# Altium project MB1605.PrjPcb (part 6 of 7)

## Sheet SDcard_eMMC.SchDoc: SDcard_eMMC
size A3; Date: Not used; ApprovedBy: Not used; CheckedBy: Not used; Author: Not used; CompanyName: STMicroelectronics; DrawnBy: Not used; Engineer: Not used; Organization: Not used; Address1: Not used; Address2: Not used; Address3: Not used; Address4: Not used; DocumentNumber: Not used; Revision: Not used; SheetNumber: 7; SheetTotal: 18; CurrentTime: Not used; CurrentDate: Not used; Time: Not used; DocumentFullPathAndName: Not used; DocumentName: Not used; ModifiedDate: Not used; ImagePath: Not used; ProjectName: Not used; Application_BuildNumber: Not used
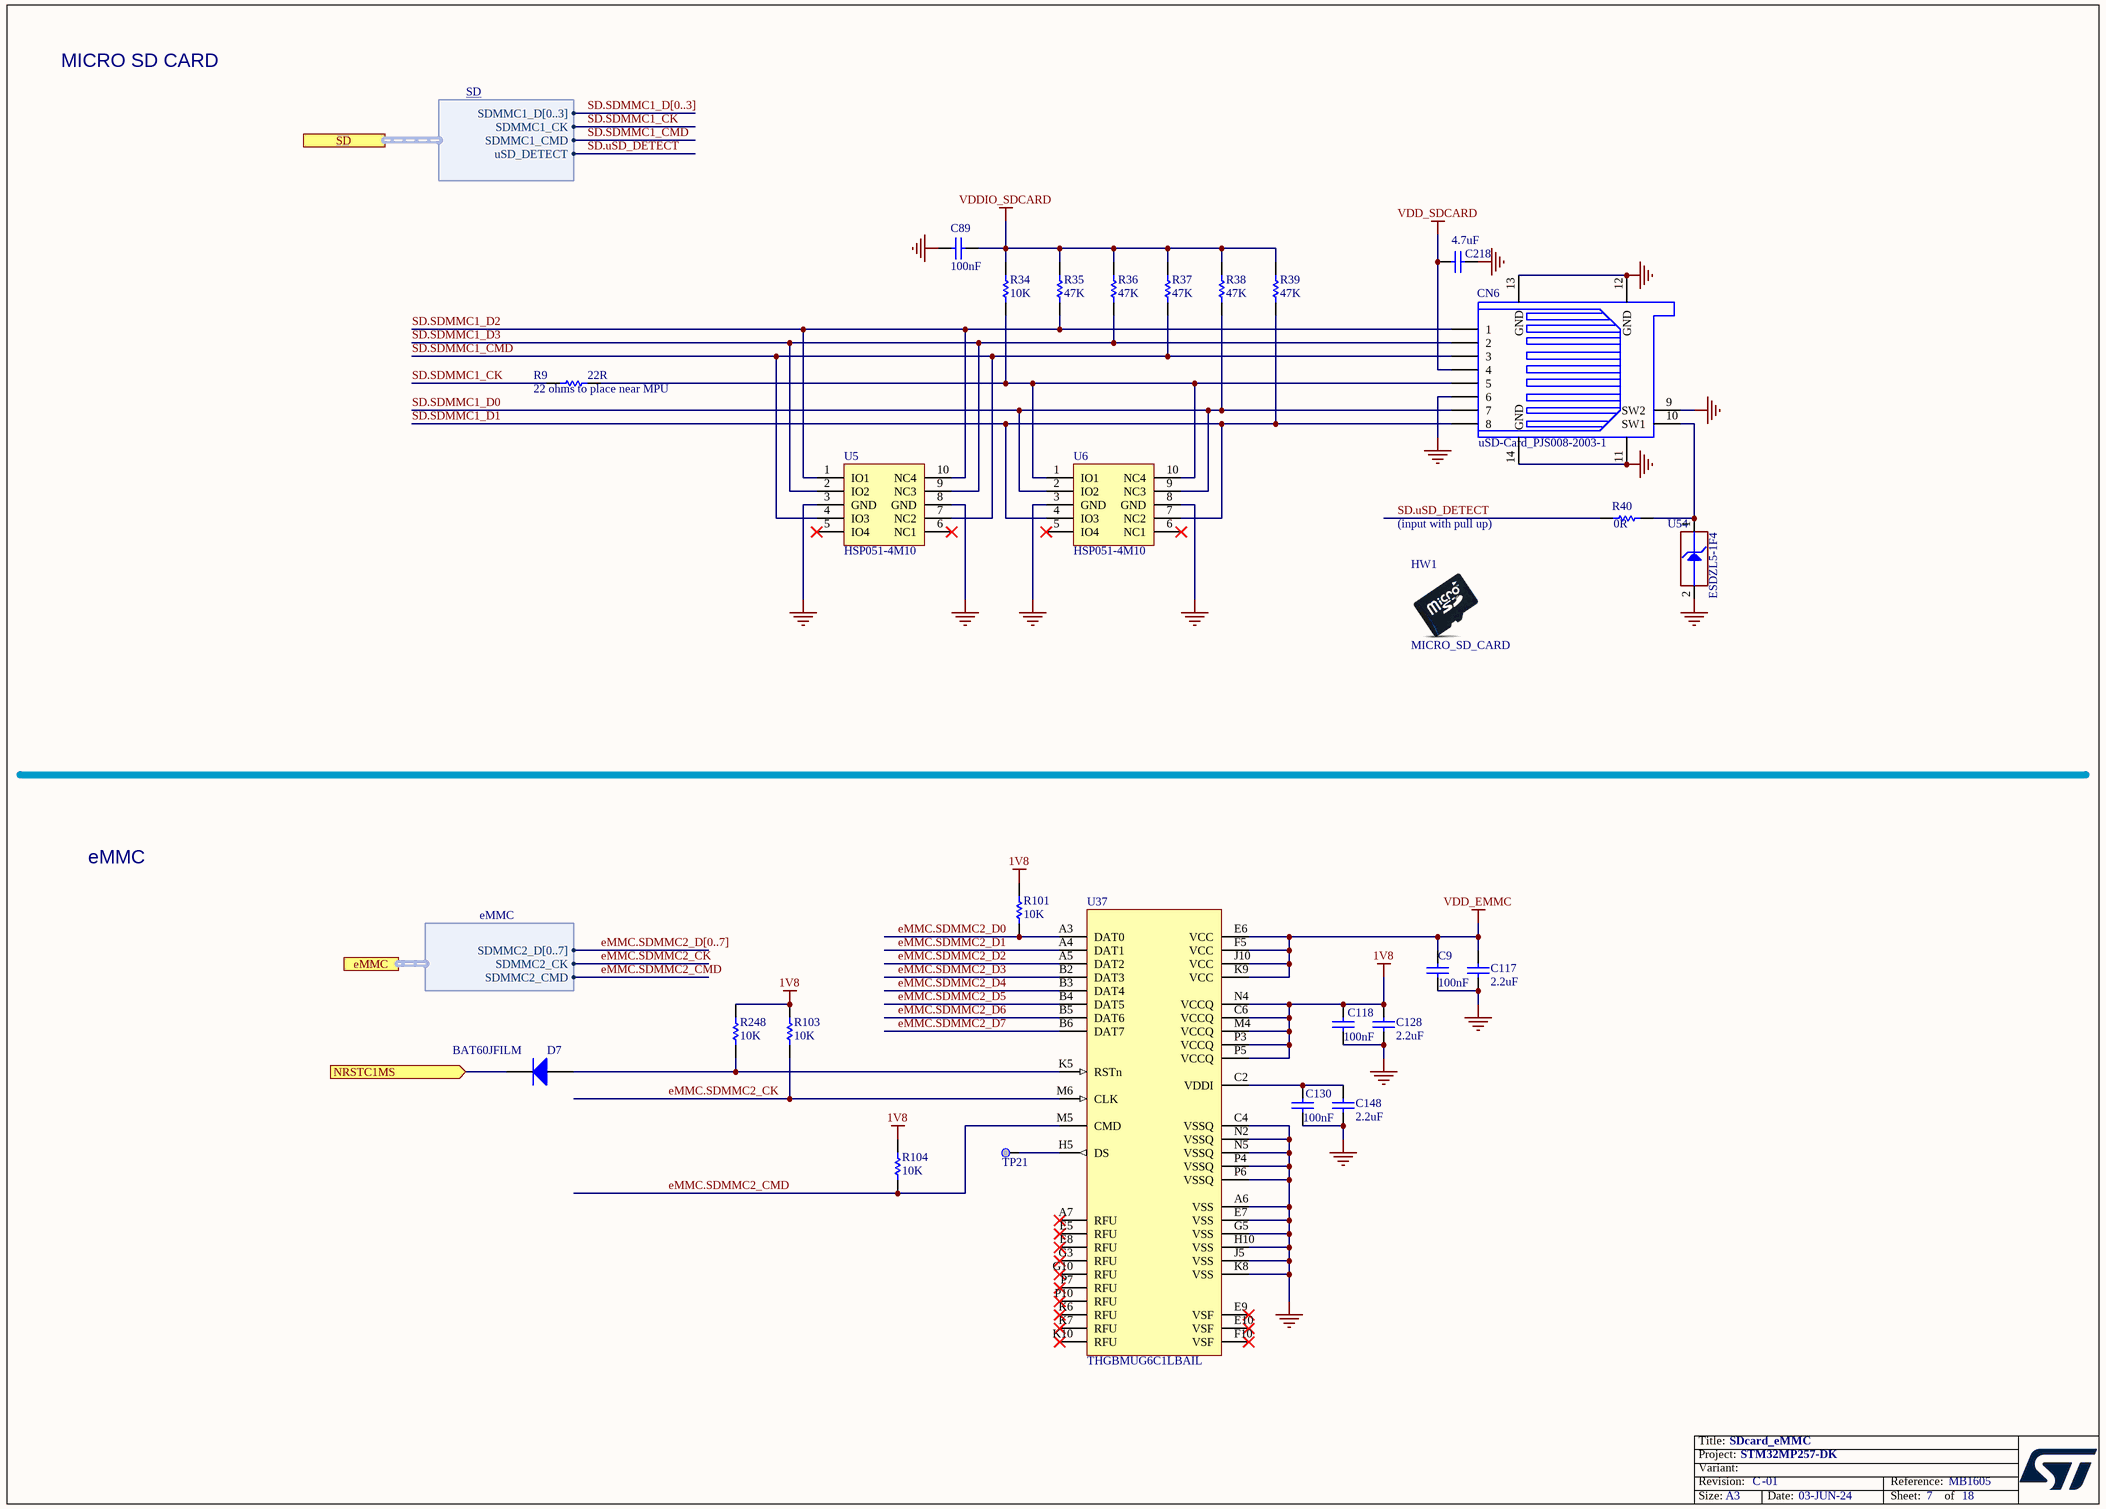
[diagram p15: SDcard_eMMC.SchDoc]

### Parts
C9  value 100nF  [C0402]  (hidden comment: Capacitor)
C89  value 100nF  [C0402]  (hidden comment: Capacitor)
C117  value 2.2uF  [C0402]  (hidden comment: Capacitor)
C118  value 100nF  [C0402]  (hidden comment: Capacitor)
C128  value 2.2uF  [C0402]  (hidden comment: Capacitor)
C130  value 100nF  [C0402]  (hidden comment: Capacitor)
C148  value 2.2uF  [C0402]  (hidden comment: Capacitor)
C218  value 4.7uF  [C0402]  (hidden comment: Capacitor)
CN6  value uSD-Card_PJS008-2003-1  [CON_MICROSD_YAMAICHI_PJS008-2003-1]  (hidden comment: microSD-PJS008-2003)
D7  BAT60JFILM  [DIO_SOD323]
HW1  Micro_SD_card  (mechanical)
R9  value 22R  [R0201_H0P23]  (hidden comment: Resistor)
R34  value 10K  [R0402]  (hidden comment: Resistor)
R35  value 47K  [R0402]  (hidden comment: Resistor)
R36  value 47K  [R0402]  (hidden comment: Resistor)
R37  value 47K  [R0402]  (hidden comment: Resistor)
R38  value 47K  [R0402]  (hidden comment: Resistor)
R39  value 47K  [R0402]  (hidden comment: Resistor)
R40  value 0R  [R0402]  (hidden comment: Resistor)
R101  value 10K  [R0402]  (hidden comment: Resistor)
R103  value 10K  [R0402]  (hidden comment: Resistor)
R104  value 10K  [R0402]  (hidden comment: Resistor)
R248  value 10K  [R0402]  (hidden comment: Resistor)
TP21  Test Point  [TP_SMD_1MM]  (value not drawn)  (no BOM)
U5  HSP051-4M10  [ESD_UQFN-10L_2P5X1_P050]
U6  HSP051-4M10  [ESD_UQFN-10L_2P5X1_P050]
U37  value THGBMUG6C1LBAIL  [ICC_WFBGA153_13X11P5_P050]  (hidden comment: eMMC_THGBMUG6C1LBAIL)
U54  value ESDZL5-1F4  [ESD_ST0201]  (hidden comment: ESD-TRANSIL)

### Ports
eMMC (harness eMMC), NRSTC1MS (in), SD (harness SD)

### Harnesses
SD: SDMMC1_D[0..3], SDMMC1_CK, SDMMC1_CMD, uSD_DETECT
eMMC: SDMMC2_CK, SDMMC2_CMD, SDMMC2_D[0..7]

### Nets
1V8: C118.2 C128.2 R101.2 R103.2 R104.2 R248.2 U37.C6(VCCQ) U37.M4(VCCQ) U37.N4(VCCQ) U37.P3(VCCQ) U37.P5(VCCQ)
GND: C9.1 C89.1 C117.1 C118.1 C128.1 C130.1 C148.1 C218.1 CN6.6 CN6.9(SW2) CN6.11(GND) CN6.12(GND) CN6.13(GND) CN6.14(GND) U5.3(GND) U5.8(GND) U6.3(GND) U6.8(GND) U37.A6(VSS) U37.C4(VSSQ) U37.E7(VSS) U37.G5(VSS) U37.H10(VSS) U37.J5(VSS) U37.K8(VSS) U37.N2(VSSQ) U37.N5(VSSQ) U37.P4(VSSQ) U37.P6(VSSQ) U54.2(GND)
VDD_EMMC: C9.2 C117.2 U37.E6(VCC) U37.F5(VCC) U37.J10(VCC) U37.K9(VCC)
VDD_SDCARD: C218.2 CN6.4
VDDIO_SDCARD: C89.2 R34.2 R35.2 R36.2 R37.2 R38.2 R39.2
eMMC.SDMMC2_CK: R103.1 U37.M6(CLK) ; port eMMC.SDMMC2_CK
eMMC.SDMMC2_CMD: R104.1 U37.M5(CMD) ; port eMMC.SDMMC2_CMD
eMMC.SDMMC2_D0: R101.1 U37.A3(DAT0)
eMMC.SDMMC2_D1: U37.A4(DAT1)
eMMC.SDMMC2_D2: U37.A5(DAT2)
eMMC.SDMMC2_D3: U37.B2(DAT3)
eMMC.SDMMC2_D4: U37.B3(DAT4)
eMMC.SDMMC2_D5: U37.B4(DAT5)
eMMC.SDMMC2_D6: U37.B5(DAT6)
eMMC.SDMMC2_D7: U37.B6(DAT7)
NRSTC1MS: D7.2(K) ; port NRSTC1MS
SD.SDMMC1_CK: R9.1 ; port SD.SDMMC1_CK
SD.SDMMC1_CMD: CN6.3 R37.1 U5.4(IO3) U5.7(NC2) ; port SD.SDMMC1_CMD
SD.SDMMC1_D0: CN6.7 R38.1 U6.2(IO2) U6.9(NC3)
SD.SDMMC1_D1: CN6.8 R39.1 U6.4(IO3) U6.7(NC2)
SD.SDMMC1_D2: CN6.1 R35.1 U5.1(IO1) U5.10(NC4)
SD.SDMMC1_D3: CN6.2 R36.1 U5.2(IO2) U5.9(NC3)
SD.uSD_DETECT: R40.1 ; port SD.uSD_DETECT
NetC130_2: C130.2 C148.2 U37.C2(VDDI)
NetCN6_5: CN6.5 R9.2 R34.1 U6.1(IO1) U6.10(NC4)
NetCN6_10: CN6.10(SW1) R40.2 U54.1(IO1)
NetD7_1: D7.1(A) R248.1 U37.K5(RSTn)
NetTP21_1: TP21.1 U37.H5(DS)

Not connected (* = marked no-connect by the designer): U5 5(IO4)* 6(NC1)*; U6 5(IO4)* 6(NC1)*; U37 A7(RFU)* E5(RFU)* E8(RFU)* E9(VSF)* E10(VSF)* F10(VSF)* G3(RFU)* G10(RFU)* K6(RFU)* K7(RFU)* K10(RFU)* P7(RFU)* P10(RFU)*

### Buses and harness runs
bus eMMC.SDMMC2_D[0..7]
bus SD.SDMMC1_D[0..3]

### Notes on the sheet
- MICRO SD CARD
- (near R9) 22 ohms to place near MPU
- (near HW1) (input with pull up)
- eMMC
- Title:
- Project:
- Size:
- Revision:
- Variant:
- A3
- -
- Date:
- Reference:
- Sheet:
- of

### Library data of the parts
C9 C89 C118 C130 = MCD-00006: Capacitor, MLCC, 100nF, 16V, X7R, +/-10%, 0402, T=0.5mm; Part_Preference: Recommended; Manufacturer: YAGEO; Manufacturer_Part_Number: CC0402KRX7R7BB104; Alternate_Manufacturer: MURATA; Alternate_Manufacturer_Part_Number: GCM155R71C104KA55D; Partial_Alternate_Internal_Part_Number: MCD-03299; Order_Code_RS: 616-9701; Component_Country_Of_Origin: China; Alternate_EMS: M; ID: 2474; ShowFields: YES; Internal_Part_Number: MCD-00006; Status: Released; Part_Type: Capacitor; Package: 0402; ComponentLink1Description: Datasheet; ComponentLink1URL: http://tunmcdsvn.tun.st.com/Component_Documentation_Library/Trunk/Capacitor/YAGEO_X7R_Series; Order_Code_Digikey: 311-1338-1-ND; Order_Code_Farnell: 9402047
C117 C128 C148 = MCD-02606: Capacitor, MLCC, 2.2uF, 6.3V, X5R, +/-10%, 0402, T=0.5mm; Part_Preference: Recommended; Manufacturer: YAGEO; Manufacturer_Part_Number: CC0402KRX5R5BB225; Order_Code_RS: 1992205; ShowFields: YES; ID: 4712; Component_Country_Of_Origin: China°; Internal_Part_Number: MCD-02606; Status: Checked; Part_Type: Capacitor; Package: 0402; ComponentLink1URL: http://tunmcdsvn.tun.st.com/Component_Documentation_Library/Trunk/Capacitor/YAGEO_X5R_Series; Order_Code_Digikey: 311-1682-2-ND; Order_Code_Farnell: 3366429
C218 = MCD-01356: Capacitor, MLCC, 4.7uF, 6V3, X5R, 20%, 0402, T=0,5mm; Manufacturer_Part_Number: GRM155R60J475ME47; Manufacturer: MURATA; Alternate_Manufacturer_Part_Number: GRM155R60J475ME87; Part_Preference: Recommended; Provided_By: SUBCO; ECCN_EU: NEC; ECCN_US: EAR99; Order_Code_RS: 814-5230; Component_Country_Of_Origin: Japan; ID: 3456; ShowFields: YES; Internal_Part_Number: MCD-01356; Status: Released; Part_Type: Capacitor; Package: 0402; ComponentLink1Description: Datasheet; ComponentLink1URL: http://tunmcdsvn.tun.st.com/Component_Documentation_Library/Trunk/Capacitor/MURATA_GRM_Series; Alternate_Manufacturer: MURATA; Order_Code_Digikey: 490-5915-1-ND; Order_Code_Farnell: 2666407
CN6 = MCD-00023: MicroSD Card Conn, Reversed-Type, Mnt Push-Push, Positionning holes; Manufacturer_Part_Number: PJS008-2003-1; Manufacturer: YAMAICHI; Part_Type: Connector; Part_Preference: Recommended; Provided_By: SUBCO; Component_Country_Of_Origin: Unknown; ID: 2492; ShowFields: YES; Internal_Part_Number: MCD-00023; ComponentLink1Description: Datasheet; ECCN_US: n/a; ECCN_EU: n/a; Status: Released; ComponentLink1URL: http://tunmcdsvn.tun.st.com/Component_Documentation_Library/Trunk/Connector/YAMAICHI_PJS_Series/; Alternate_Manufacturer: N/A; Alternate_Manufacturer_Part_Number: N/A; Order_Code_Digikey: N/A; Order_Code_Farnell: N/A; Order_Code_RS: N/A
D7 = MCD-00034: BMS_Part_Number: 9151097; Part_Type: Diode; Part_Preference: Recommended; Manufacturer: STMICROELECTRONICS; Manufacturer_HQ_COO: EU; Component_Country_Of_Origin: China; ShowFields: YES; ID: 2483; Internal_Part_Number: MCD-00034; Value: BAT60JFILM; Status: Released; Manufacturer_Part_Number: BAT60JFILM; ComponentLink1URL: http://tunmcdsvn.tun.st.com/Component_Datasheet_Library/Trunk/Diodes/STM_Diode_BAT60JFILM-SOD323
HW1 = MCD-03307: MICRO_SD_CARD, SANDISK, 16GB, Class10, 3V; Part_Type: Mechanical; Part_Preference: Recommended; Manufacturer_Part_Number: SDSDQAD-016G; Order_Code_RS: 220-8618; Component_Country_Of_Origin: China°; ShowFields: YES; ID: 5423; Internal_Part_Number: MCD-03307; Value: MICRO_SD_CARD; Status: Released; Manufacturer: SANDISK; Package: N/A; ComponentLink1URL: http://tunmcdsvn.tun.st.com/Component_Documentation_Library/Trunk/Mechanical/SANDISK_SDSDQAD-016G; Order_Code_Digikey: N/A; Order_Code_Farnell: N/A
R9 = MCD-02978: Resistor, 22R, 0201, +/-1%, 1/20W; Manufacturer_Part_Number: RC0201FR-0722RL; Manufacturer: YAGEO; Part_Preference: Recommended; Order_Code_RS: 198-7593; ID: 5094; ShowFields: YES; Component_Country_Of_Origin: China; Internal_Part_Number: MCD-02978; Status: Checked; Part_Type: Resistor; ComponentLink1URL: http://tunmcdsvn.tun.st.com/Component_Documentation_Library/Trunk/Resistor/YAGEO_RC_L_Series; Package: 0201; Order_Code_Digikey: YAG2518TR-ND; Order_Code_Farnell: 2693564
R34 R101 R103 R104 R248 = MCD-00053: Resistor,10K,0402,1%,1/16W; Manufacturer_Part_Number: RC0402FR-0710KL; Manufacturer: YAGEO; BMS_Part_Number: 9131590; Part_Preference: Recommended; ECCN_US: EAR99; ECCN_EU: NEC; Provided_By: SUBCO; Component_Country_Of_Origin: China; ID: 2539; ShowFields: YES; Internal_Part_Number: MCD-00053; ComponentLink1Description: Datasheet; Status: Released; Part_Type: Resistor; ComponentLink1URL: http://tunmcdsvn.tun.st.com/Component_Documentation_Library/Trunk/Resistor/YAGEO_RC_L_Series; Package: 0402; Order_Code_Digikey: 311-10.0KLRCT-ND; Order_Code_Farnell: 9239359; Order_Code_RS: N/A
  R34: Alternate_Manufacturer: N/A; Alternate_Manufacturer_Part_Number: N/A
R35-R39 = MCD-00063: Resistor,47K,0402,1%,1/16W; Manufacturer_Part_Number: RC0402FR-0747KL; Manufacturer: YAGEO; Part_Preference: Recommended; ECCN_US: EAR99; ECCN_EU: NEC; Provided_By: SUBCO; Component_Country_Of_Origin: China; ID: 2528; ShowFields: YES; Internal_Part_Number: MCD-00063; ComponentLink1Description: Datasheet; Status: Released; Part_Type: Resistor; ComponentLink1URL: http://tunmcdsvn.tun.st.com/Component_Documentation_Library/Trunk/Resistor/YAGEO_RC_L_Series; Package: 0402; Alternate_Manufacturer: N/A; Alternate_Manufacturer_Part_Number: N/A; Order_Code_Digikey: 311-47.0KLRCT-ND; Order_Code_Farnell: 9239430; Order_Code_RS: N/A
R40 = MCD-00052: Resistor,0R,0402,5%,1/16W; Manufacturer_Part_Number: RC0402JR-070RL; Manufacturer: YAGEO; Part_Preference: Recommended; ECCN_US: EAR99; ECCN_EU: NEC; Provided_By: SUBCO; Order_Code_RS: 618-5804; Component_Country_Of_Origin: China; ID: 2540; ShowFields: YES; Internal_Part_Number: MCD-00052; ComponentLink1Description: Datasheet; Status: Released; Part_Type: Resistor; ComponentLink1URL: http://tunmcdsvn.tun.st.com/Component_Documentation_Library/Trunk/Resistor/YAGEO_RC_L_Series; Package: 0402; Alternate_Manufacturer: N/A; Alternate_Manufacturer_Part_Number: N/A; Order_Code_Digikey: 311-0.0JRCT-ND; Order_Code_Farnell: 9232516RL
TP21 = MCD-00074: Test Point 1mm; Part_Type: Misc; Part_Preference: Recommended; ID: 2518; ShowFields: YES; Internal_Part_Number: MCD-00074; Status: Released; Manufacturer_Part_Number: n/a; Manufacturer: n/a; ComponentLink1Description: Datasheet; ComponentLink1URL: http://na; ECCN_US: n/a; ECCN_EU: n/a; Provided_By: n/a; Order_Code_Digikey: N/A; Order_Code_Farnell: N/A; Order_Code_RS: N/A
U5 U6 = MCD-00667: 4-line ESD protection for high speed lines; Part_Type: Diode; Manufacturer: STMICROELECTRONICS; BMS_Part_Number: 9179041; Manufacturer_HQ_COO: EU; Part_Preference: Recommended; ECCN_US: EAR99; ECCN_EU: NEC; Provided_By: SUBCO with ST control; Component_Country_Of_Origin: Philippines; ID: 3081; ShowFields: YES; Internal_Part_Number: MCD-00667; Value: HSP051-4M10; Status: Released; Manufacturer_Part_Number: HSP051-4M10; Package: uQFN-10L; ComponentLink1Description: Datasheet; ComponentLink1URL: http://tunmcdsvn.tun.st.com/Component_Documentation_Library/Trunk/Diode/STMICROELECTRONICS_HSP051-4M10; Order_Code_Digikey: N/A; Order_Code_Farnell: N/A; Order_Code_RS: N/A
U37 = MCD-04155: Memory, eMMC, 3V3, 8Gbit, 52MHz , V5.1; Part_Type: IC; Part_Preference: Recommended; Manufacturer: KIOXIA; ShowFields: YES; ID: 6271; ComponentLink1URL: http://tunmcdsvn.tun.st.com/Component_Documentation_Library/Trunk/IC/KIOXIA_THGBMUG6C1LBAIL; Internal_Part_Number: MCD-04155; Status: New; Manufacturer_Part_Number: THGBMUG6C1LBAIL; Package: WFBGA153; Order_Code_Digikey: 1853-THGBMUG6C1LBAIL-ND; Order_Code_Farnell: N/A; Order_Code_RS: N/A
U54 = MCD-03501: ESD protection , 0201; Part_Type: IC; Part_Preference: Recommended; Manufacturer: STMICROELECTRONICS; ShowFields: YES; ID: 5617; Order_Code_RS: 163-7318; Internal_Part_Number: MCD-03501; Status: New; Manufacturer_Part_Number: ESDZL5-1F4; ComponentLink1URL: http://tunmcdsvn.tun.st.com/Component_Documentation_Library/Trunk/IC/STMICROELECTRONICS_ESDZL5-1F4; Order_Code_Digikey: 497-17544-2-ND; Order_Code_Farnell: ESDZL5-1F4; Package: 0201; Full_Alternate_Internal_Part_Number: N/A

## Sheet ETHERNET.SchDoc: ETHERNET
size A3; Date: Not used; ApprovedBy: Not used; CheckedBy: Not used; Author: Not used; CompanyName: STMicroelectronics; DrawnBy: Not used; Engineer: Not used; Organization: Not used; Address1: Not used; Address2: Not used; Address3: Not used; Address4: Not used; DocumentNumber: Not used; Revision: Not used; SheetNumber: 8; SheetTotal: 18; CurrentTime: Not used; CurrentDate: Not used; Time: Not used; DocumentFullPathAndName: Not used; DocumentName: Not used; ModifiedDate: Not used; ImagePath: Not used; ProjectName: Not used; Application_BuildNumber: Not used
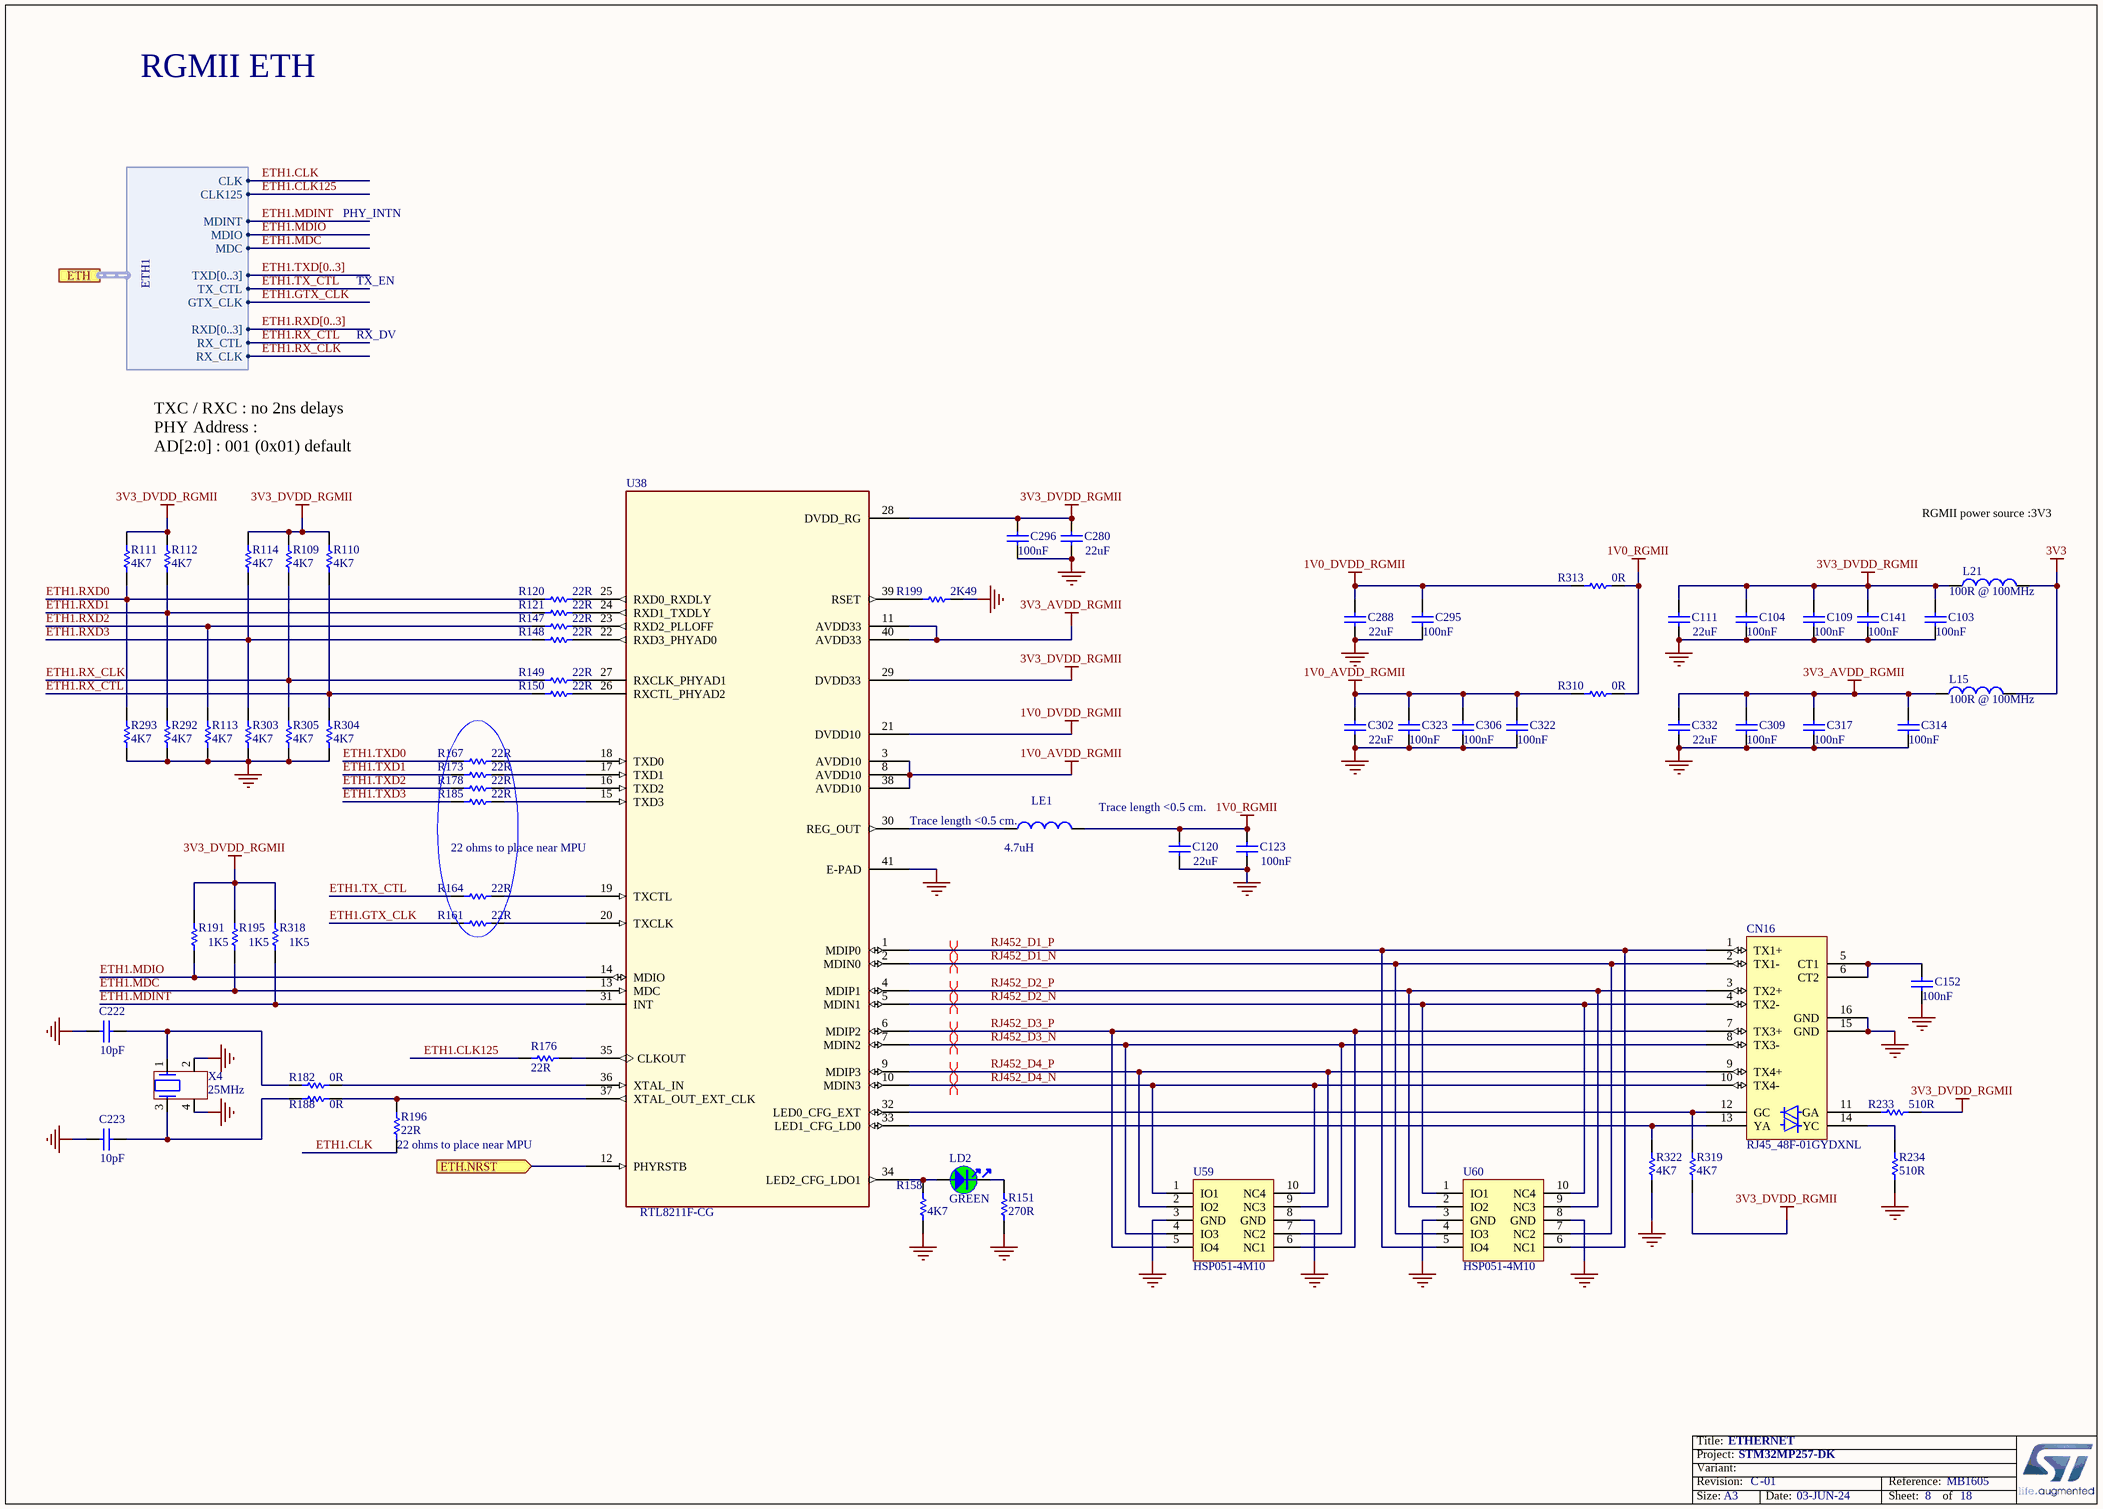
[diagram p16: ETHERNET.SchDoc]

### Parts
C103  value 100nF  [C0402]
C104  value 100nF  [C0402]
C109  value 100nF  [C0402]
C111  value 22uF  [C0603]
C120  value 22uF  [C0603]
C123  value 100nF  [C0402]
C141  value 100nF  [C0402]
C152  value 100nF  [C0402]
C222  value 10pF  [C0402]
C223  value 10pF  [C0402]
C280  value 22uF  [C0603]
C288  value 22uF  [C0603]
C295  value 100nF  [C0402]
C296  value 100nF  [C0402]
C302  value 22uF  [C0603]
C306  value 100nF  [C0402]
C309  value 100nF  [C0402]
C314  value 100nF  [C0402]
C317  value 100nF  [C0402]
C322  value 100nF  [C0402]
C323  value 100nF  [C0402]
C332  value 22uF  [C0603]
CN16  value RJ45_48F-01GYDXNL  [CON_RJ45_YD_48F-01GYDXNL_LED-P]  (hidden comment: ​New part for use of led pulled down on pin 13/14 , schematic more lisible.)
L15  value 100R @ 100MHz  [FIL_0603_H0P65]
L21  value 100R @ 100MHz  [FIL_0603_H0P65]
LD2  value GREEN  [LED_0603_OSRAM_LG-Q396-PS-35_GREEN_1A2K_H0P4]  (hidden comment: LED_green)
LE1  value 4.7uH  [L1210_LQH]
R109  value 4K7  [R0402]
R110  value 4K7  [R0402]
R111  value 4K7  [R0402]
R112  value 4K7  [R0402]
R113  value 4K7  [R0402]
R114  value 4K7  [R0402]
R120  value 22R  [R0201_H0P23]  (hidden comment: Resistor)
R121  value 22R  [R0201_H0P23]  (hidden comment: Resistor)
R147  value 22R  [R0201_H0P23]  (hidden comment: Resistor)
R148  value 22R  [R0201_H0P23]  (hidden comment: Resistor)
R149  value 22R  [R0201_H0P23]  (hidden comment: Resistor)
R150  value 22R  [R0201_H0P23]  (hidden comment: Resistor)
R151  value 270R  [R0402]  (hidden comment: Resistor)
R158  value 4K7  [R0402]
R161  value 22R  [R0201_H0P23]  (hidden comment: Resistor)
R164  value 22R  [R0201_H0P23]  (hidden comment: Resistor)
R167  value 22R  [R0201_H0P23]  (hidden comment: Resistor)
R173  value 22R  [R0201_H0P23]  (hidden comment: Resistor)
R176  value 22R  [R0201_H0P23]  (hidden comment: Resistor)
R178  value 22R  [R0201_H0P23]  (hidden comment: Resistor)
R182  value 0R  [R0402]
R185  value 22R  [R0201_H0P23]  (hidden comment: Resistor)
R188  value 0R  [R0402]
R191  value 1K5  [R0402]
R195  value 1K5  [R0402]
R196  value 22R  [R0201_H0P23]  (hidden comment: Resistor)
R199  value 2K49  [R0402]
R233  value 510R  [R0402]
R234  value 510R  [R0402]
R292  value 4K7  [R0402]
R293  value 4K7  [R0402]
R303  value 4K7  [R0402]
R304  value 4K7  [R0402]
R305  value 4K7  [R0402]
R310  value 0R  [R0603]
R313  value 0R  [R0603]
R318  value 1K5  [R0402]
R319  value 4K7  [R0402]
R322  value 4K7  [R0402]
U38  RTL8211F-CG  [ICC_QFN40-EPAD_5X5_P040]
U59  HSP051-4M10  [ESD_UQFN-10L_2P5X1_P050]
U60  HSP051-4M10  [ESD_UQFN-10L_2P5X1_P050]
X4  value 25MHz  [CRY_NX3225HA_4P]  (hidden comment: XTAL_4_PINS)

### Ports
ETH (harness ETH1), ETH.NRST (in)

### Harnesses
ETH1: MDINT, CLK125, TXD[0..3], MDIO, MDC, RX_CLK, GTX_CLK, TX_CTL, RXD[0..3], RX_CTL, CLK

### Nets
1V0_AVDD_RGMII: C302.2 C306.2 C322.2 C323.2 R310.1 U38.3(AVDD10) U38.8(AVDD10) U38.38(AVDD10)
1V0_DVDD_RGMII: C288.2 C295.2 R313.1 U38.21(DVDD10)
1V0_RGMII: C120.2 C123.2 LE1.2 R310.2 R313.2
3V3: L15.2 L21.2
3V3_AVDD_RGMII: C309.2 C314.2 C317.2 C332.2 L15.1 U38.11(AVDD33) U38.40(AVDD33)
3V3_DVDD_RGMII: C103.2 C104.2 C109.2 C111.2 C141.2 C280.1 C296.2 L21.1 R109.2 R110.2 R111.2 R112.2 R114.2 R191.2 R195.2 R233.2 R318.2 R319.1 U38.28(DVDD_RG) U38.29(DVDD33)
GND: C103.1 C104.1 C109.1 C111.1 C120.1 C123.1 C141.1 C152.1 C222.1 C223.1 C280.2 C288.1 C295.1 C296.1 C302.1 C306.1 C309.1 C314.1 C317.1 C322.1 C323.1 C332.1 CN16.15(GND) CN16.16(GND) R113.1 R151.2 R158.1 R199.2 R234.1 R292.1 R293.1 R303.1 R304.1 R305.1 R322.1 U38.41(E-PAD) U59.3(GND) U59.8(GND) U60.3(GND) U60.8(GND) X4.2 X4.4
ETH1.CLK: R196.1 ; port ETH.CLK
ETH1.CLK125: R176.1 ; port ETH.CLK125
ETH1.GTX_CLK: R161.1 ; port ETH.GTX_CLK
ETH1.MDC: R195.1 U38.13(MDC) ; port ETH.MDC
ETH1.MDINT: R318.1 U38.31(INT) ; port ETH.MDINT
ETH1.MDIO: R191.1 U38.14(MDIO) ; port ETH.MDIO
ETH1.NRST: U38.12(PHYRSTB) ; port ETH.NRST
ETH1.RX_CLK: R109.1 R149.1 R305.2 ; port ETH.RX_CLK
ETH1.RX_CTL: R110.1 R150.1 R304.2 ; port ETH.RX_CTL
ETH1.RXD0: R111.1 R120.1 R293.2
ETH1.RXD1: R112.1 R121.1 R292.2
ETH1.RXD2: R113.2 R147.1
ETH1.RXD3: R114.1 R148.1 R303.2
ETH1.TX_CTL: R164.1 ; port ETH.TX_CTL
ETH1.TXD0: R167.1
ETH1.TXD1: R173.1
ETH1.TXD2: R178.1
ETH1.TXD3: R185.1
RJ452_D1_N: CN16.2(TX1-) U38.2(MDIN0) U60.4(IO3) U60.7(NC2)
RJ452_D1_P: CN16.1(TX1+) U38.1(MDIP0) U60.5(IO4) U60.6(NC1)
RJ452_D2_N: CN16.4(TX2-) U38.5(MDIN1) U60.1(IO1) U60.10(NC4)
RJ452_D2_P: CN16.3(TX2+) U38.4(MDIP1) U60.2(IO2) U60.9(NC3)
RJ452_D3_N: CN16.8(TX3-) U38.7(MDIN2) U59.4(IO3) U59.7(NC2)
RJ452_D3_P: CN16.7(TX3+) U38.6(MDIP2) U59.5(IO4) U59.6(NC1)
RJ452_D4_N: CN16.10(TX4-) U38.10(MDIN3) U59.1(IO1) U59.10(NC4)
RJ452_D4_P: CN16.9(TX4+) U38.9(MDIP3) U59.2(IO2) U59.9(NC3)
NetC152_2: C152.2 CN16.5(CT1) CN16.6(CT2)
NetC222_2: C222.2 R182.1 X4.1
NetC223_2: C223.2 R188.1 X4.3
NetCN16_11: CN16.11(GA) R233.1
NetCN16_12: CN16.12(GC) R319.2 U38.32(LED0_CFG_EXT)
NetCN16_13: CN16.13(YA) R322.2 U38.33(LED1_CFG_LD0)
NetCN16_14: CN16.14(YC) R234.2
NetLD2_1: LD2.1 R158.2 U38.34(LED2_CFG_LDO1)
NetLD2_2: LD2.2 R151.1
NetLE1_1: LE1.1 U38.30(REG_OUT)
NetR120_2: R120.2 U38.25(RXD0_RXDLY)
NetR121_2: R121.2 U38.24(RXD1_TXDLY)
NetR147_2: R147.2 U38.23(RXD2_PLLOFF)
NetR148_2: R148.2 U38.22(RXD3_PHYAD0)
NetR149_2: R149.2 U38.27(RXCLK_PHYAD1)
NetR150_2: R150.2 U38.26(RXCTL_PHYAD2)
NetR161_2: R161.2 U38.20(TXCLK)
NetR164_2: R164.2 U38.19(TXCTL)
NetR167_2: R167.2 U38.18(TXD0)
NetR173_2: R173.2 U38.17(TXD1)
NetR176_2: R176.2 U38.35(CLKOUT)
NetR178_2: R178.2 U38.16(TXD2)
NetR182_2: R182.2 U38.36(XTAL_IN)
NetR185_2: R185.2 U38.15(TXD3)
NetR188_2: R188.2 R196.2 U38.37(XTAL_OUT_EXT_CLK)
NetR199_1: R199.1 U38.39(RSET)

### Buses and harness runs
bus ETH1.RXD[0..3]
bus ETH1.TXD[0..3]

### Layout directives
differential pair: RJ452_D1_N, RJ452_D1_P, RJ452_D2_N, RJ452_D2_P, RJ452_D3_N, RJ452_D3_P, RJ452_D4_N, RJ452_D4_P

### Notes on the sheet
- RGMII ETH
- PHY_INTN
- TX_EN
- RX_DV
- TXC / RXC : no 2ns delays
  PHY Address :
  AD[2:0] : 001 (0x01) default
- RGMII power source :3V3
- (near U38) 22 ohms to place near MPU
- (near LE1) Trace length <0.5 cm.
- Trace length <0.5 cm.
- (near R196) 22 ohms to place near MPU
- Title:
- Project:
- Size:
- Revision:
- Variant:
- A3
- -
- Date:
- Reference:
- Sheet:
- of

### Library data of the parts
C103 C104 C109 C123 C141 C152 C295 C296 C306 C309 C314 C317 C322 C323 = MCD-00006: Capacitor,100nF,16V,X7R,10%,0402; Manufacturer_Part_Number: CC0402KRX7R7BB104; Manufacturer: YAGEO; Alternate_Manufacturer: MURATA; Alternate_Manufacturer_Part_Number: GCM155R71C104KA55D; Part_Preference: Recommended; Partial_Alternate_Internal_Part_Number: MCD-03299; Provided_By: SUBCO; Initial_Board_Reference: mb1274; Order_Code_RS: 616-9701; Alternate_EMS: M; Component_Country_Of_Origin: China; ID: 2474; ShowFields: YES; Internal_Part_Number: MCD-00006; ComponentLink1Description: Datasheet; ECCN_US: n/a; ECCN_EU: n/a; Status: Released; Part_Type: Capacitor; Package: 0402; ComponentLink1URL: http://tunmcdsvn.tun.st.com/Component_Documentation_Library/Trunk/Capacitor/YAGEO_X7R_Series; Order_Code_Digikey: 311-1338-1-ND; Order_Code_Farnell: 9402047
C111 C120 C280 C288 C302 C332 = MCD-00100: Capacitor,22uF,6V3,X5R,20%,0603; Manufacturer_Part_Number: GRM188R60J226MEA0J; Manufacturer: MURATA; Part_Preference: Recommended; ECCN_US: EAR99; ECCN_EU: NEC; Provided_By: SUBCO; Initial_Board_Reference: mb1262; Component_Country_Of_Origin: Japan; ID: 2766; ShowFields: YES; Internal_Part_Number: MCD-00100; ComponentLink1Description: Datasheet; Status: Released; Part_Type: Capacitor; Package: 0603; ComponentLink1URL: http://tunmcdsvn.tun.st.com/Component_Documentation_Library/Trunk/Capacitor/MURATA_GRM_Series; Order_Code_Digikey: 490-7612-2-ND; Order_Code_Farnell: N/A; Order_Code_RS: N/A
C222 C223 = MCD-00015: Capacitor,10pF,50V,NPO,5%,0402; Manufacturer_Part_Number: CC0402JRNPO9BN100; Manufacturer: YAGEO; Part_Preference: Recommended; Provided_By: SUBCO; Initial_Board_Reference: mb1274; Order_Code_RS: 616-9256; Component_Country_Of_Origin: China; ID: 2465; ShowFields: YES; Internal_Part_Number: MCD-00015; ComponentLink1Description: Datasheet; ECCN_US: n/a; ECCN_EU: n/a; Status: Released; Part_Type: Capacitor; Package: 0402; ComponentLink1URL: http://tunmcdsvn.tun.st.com/Component_Documentation_Library/Trunk/Capacitor/YAGEO_NP0_Series; Order_Code_Digikey: 311-1014-1-ND; Order_Code_Farnell: 3019160RL
CN16 = MCD-01129: Connector_RJ45, led pull down, T= 13.84mm; Manufacturer_Part_Number: 48F-01GYDXNL; Manufacturer: YUAN DEAN SCIENTIFIC; Part_Preference: Recommended; Component_Country_Of_Origin: Unknown; ID: 3367; ShowFields: YES; Internal_Part_Number: MCD-01129; Status: Checked; Part_Type: Connector; ComponentLink1URL: http://tunmcdsvn.tun.st.com/Component_Documentation_Library/Trunk/Connector/YUAN_DEAN_SCIENTIFIC_48F_Series; Order_Code_Digikey: N/A; Order_Code_Farnell: N/A; Order_Code_RS: N/A; Package: 13.84x21.59mm
L15 L21 = MCD-00094: Ferrite bead 100R 2A 0603; Manufacturer_Part_Number: BLM18EG101TN1; Manufacturer: MURATA; Part_Type: Inductor; Part_Preference: Recommended; ECCN_US: EAR99; ECCN_EU: NEC; Provided_By: SUBCO; Initial_Board_Reference: mb1262; Order_Code_RS: 792-6246; Component_Country_Of_Origin: Japan; ID: 2774; ShowFields: YES; Internal_Part_Number: MCD-00094; ComponentLink1Description: Datasheet; Status: Released; ComponentLink1URL: http://tunmcdsvn.tun.st.com/Component_Documentation_Library/Trunk/Inductor/MURATA_BLM_Series; Order_Code_Digikey: 490-5978-2-ND; Order_Code_Farnell: 1515714; Package: 0603
LD2 = MCD-00588: LED Green, 0603 SMD, Forward Voltage Typ=2V, Max=2.5V; Part_Type: Display; Manufacturer_Part_Number: LG Q396-PS-35; Manufacturer: OSRAM OPTO SEMICONDUCTORS; Alternate_Manufacturer_Part_Number: VLMTG1300-GS08; Alternate_Manufacturer: VISHAY SEMICONDUCTOR OPTO DIVISION; Alternate_Internal_Part_Number: MCD-02400; Part_Preference: Recommended; Provided_By: SUBCO; Component_Country_Of_Origin: Unknown; ID: 3155; ShowFields: YES; Internal_Part_Number: MCD-00588; Status: Released; Package: LED 0603; ComponentLink1Description: Datasheet; ComponentLink1URL: http://tunmcdsvn.tun.st.com/Component_Documentation_Library/Trunk/Display/OSRAM_OPTO_SEMICONDUCTORS_LG-Q396-PS-35; Order_Code_Digikey: LG Q396-PS-35-ND; ECCN_US: n/a; ECCN_EU: n/a; Order_Code_Farnell: N/A; Order_Code_RS: N/A; Full_Alternate_Internal_Part_Number: MCD-02400
LE1 = MCD-00048: FIXED IND 4.7UH 1A 180 MOHM 30% SMD; Manufacturer_Part_Number: LQH32PN4R7NN0L; Manufacturer: MURATA; Part_Preference: Recommended; Provided_By: SUBCO; Initial_Board_Reference: mb1274; Order_Code_RS: 167-4086; Component_Country_Of_Origin: Japan; ID: 2544; ShowFields: YES; Internal_Part_Number: MCD-00048; ComponentLink1Description: Datasheet; ECCN_US: n/a; ECCN_EU: n/a; Status: Released; Part_Type: Inductor; ComponentLink1URL: http://tunmcdsvn.tun.st.com/Component_Documentation_Library/Trunk/Inductor/MURATA_LQH32PN4R7NN0; Order_Code_Digikey: 490-5338-2-ND; Order_Code_Farnell: 2470296; Package: 1210
R109-R114 R292 R293 R303-R305 = MCD-00065: Resistor,4K7,0402,1%,1/16W; Manufacturer_Part_Number: RC0402FR-074K7L; Manufacturer: YAGEO; Alternate_Manufacturer_Part_Number: RT0402FRE074K7L; Part_Preference: Recommended; Partial_Alternate_Internal_Part_Number: MCD-03300; Provided_By: SUBCO; Initial_Board_Reference: mb1274; Component_Country_Of_Origin: China; ID: 2526; ShowFields: YES; Alternate_EMS: M; Internal_Part_Number: MCD-00065; Alternate_Manufacturer: YAGEO; ComponentLink1Description: Datasheet; ECCN_US: n/a; ECCN_EU: n/a; Status: Released; Part_Type: Resistor; ComponentLink1URL: http://tunmcdsvn.tun.st.com/Component_Documentation_Library/Trunk/Resistor/YAGEO_RC_L_Series; Package: 0402; Order_Code_Digikey: 311-4.7KLRCT-ND; Order_Code_Farnell: 9239316; Order_Code_RS: N/A
R120 R121 R147-R150 R161 R164 R167 R173 R176 R178 R185 R196 = MCD-02978: Resistor, 22R, 0201, +/-1%, 1/20W; Manufacturer_Part_Number: RC0201FR-0722RL; Manufacturer: YAGEO; Part_Preference: Recommended; Order_Code_RS: 198-7593; ID: 5094; ShowFields: YES; Component_Country_Of_Origin: China; Internal_Part_Number: MCD-02978; Status: Checked; Part_Type: Resistor; ComponentLink1URL: http://tunmcdsvn.tun.st.com/Component_Documentation_Library/Trunk/Resistor/YAGEO_RC_L_Series; Package: 0201; Order_Code_Digikey: YAG2518TR-ND; Order_Code_Farnell: 2693564
R151 = MCD-00441: Resistor,270R,0402,1%,1/16W; Manufacturer_Part_Number: RC0402FR-07270RL; Manufacturer: YAGEO; Part_Preference: Recommended; Provided_By: SUBCO; ECCN_US: EAR99; ECCN_EU: NEC; Component_Country_Of_Origin: China; ID: 2838; ShowFields: YES; Internal_Part_Number: MCD-00441; Status: Released; Part_Type: Resistor; Package: 0402; ComponentLink1Description: Datasheet; ComponentLink1URL: http://tunmcdsvn.tun.st.com/Component_Documentation_Library/Trunk/Resistor/YAGEO_RC_L_Series; Order_Code_Digikey: 311-270LRCT-ND; Order_Code_Farnell: 9239162; Order_Code_RS: N/A
R158 R319 R322 = MCD-00065: Resistor,4K7,0402,1%,1/16W; Manufacturer_Part_Number: RC0402FR-074K7L; Manufacturer: YAGEO; Alternate_Manufacturer_Part_Number: RT0402FRE074K7L; Part_Preference: Recommended; Partial_Alternate_Internal_Part_Number: MCD-03300; Provided_By: SUBCO; Initial_Board_Reference: mb1274; Alternate_EMS: M; Component_Country_Of_Origin: China; ID: 2526; ShowFields: YES; Internal_Part_Number: MCD-00065; Alternate_Manufacturer: YAGEO; ComponentLink1Description: Datasheet; ECCN_US: n/a; ECCN_EU: n/a; Status: Released; Part_Type: Resistor; ComponentLink1URL: http://tunmcdsvn.tun.st.com/Component_Documentation_Library/Trunk/Resistor/YAGEO_RC_L_Series; Package: 0402; Order_Code_Digikey: 311-4.7KLRCT-ND; Order_Code_Farnell: 9239316; Order_Code_RS: N/A
R182 R188 = MCD-00052: Resistor,0R,0402,5%,1/16W; Manufacturer_Part_Number: RC0402JR-070RL; Manufacturer: YAGEO; Part_Preference: Recommended; Provided_By: SUBCO; Initial_Board_Reference: mb1274; Order_Code_RS: 618-5804; Component_Country_Of_Origin: China; ID: 2540; ShowFields: YES; Internal_Part_Number: MCD-00052; ComponentLink1Description: Datasheet; ECCN_US: n/a; ECCN_EU: n/a; Status: Released; Part_Type: Resistor; ComponentLink1URL: http://tunmcdsvn.tun.st.com/Component_Documentation_Library/Trunk/Resistor/YAGEO_RC_L_Series; Package: 0402; Order_Code_Digikey: 311-0.0JRCT-ND; Order_Code_Farnell: 9232516RL
R191 R195 R318 = MCD-00068: Resistor,1K5,0402,1%,1/16W; Manufacturer_Part_Number: RC0402FR-071K5L; Manufacturer: YAGEO; Part_Preference: Recommended; Provided_By: SUBCO; Initial_Board_Reference: mb1274; Component_Country_Of_Origin: China; ID: 2524; ShowFields: YES; Internal_Part_Number: MCD-00068; ComponentLink1Description: Datasheet; ECCN_US: n/a; ECCN_EU: n/a; Status: Released; Part_Type: Resistor; ComponentLink1URL: http://tunmcdsvn.tun.st.com/Component_Documentation_Library/Trunk/Resistor/YAGEO_RC_L_Series; Package: 0402; Order_Code_Digikey: 311-1.50KLRCT-ND; Order_Code_Farnell: 9239251; Order_Code_RS: N/A
R199 = MCD-00183: Resistor,2K49,0402,1%,1/16W; Manufacturer_Part_Number: RC0402FR-072K49L; Manufacturer: YAGEO; Part_Preference: Recommended; Provided_By: SUBCO; Component_Country_Of_Origin: China; ID: 2687; ShowFields: YES; Internal_Part_Number: MCD-00183; ComponentLink1Description: Datasheet; ECCN_US: n/a; ECCN_EU: n/a; Status: Released; Part_Type: Resistor; ComponentLink1URL: http://tunmcdsvn.tun.st.com/Component_Documentation_Library/Trunk/Resistor/YAGEO_RC_L_Series; Package: 0402; Order_Code_Digikey: 311-2.49KLRCT-ND; Order_Code_Farnell: 1799190; Order_Code_RS: N/A
R233 R234 = MCD-00064: Resistor,510R,0402,1%,1/16W; Manufacturer_Part_Number: RC0402FR-07510RL; Manufacturer: YAGEO; Part_Preference: Recommended; Provided_By: SUBCO; Initial_Board_Reference: mb1274; Component_Country_Of_Origin: China; ID: 2525; ShowFields: YES; Internal_Part_Number: MCD-00064; ComponentLink1Description: Datasheet; ECCN_US: n/a; ECCN_EU: n/a; Status: Released; Part_Type: Resistor; ComponentLink1URL: http://tunmcdsvn.tun.st.com/Component_Documentation_Library/Trunk/Resistor/YAGEO_RC_L_Series; Package: 0402; Order_Code_Digikey: 311-510LRCT-ND; Order_Code_Farnell: 1458804; Order_Code_RS: N/A
R310 R313 = MCD-00056: Resistor,0R,0603,5%,1/10W; Manufacturer_Part_Number: RC0603JR-070RL; Manufacturer: YAGEO; Part_Preference: Recommended; Provided_By: SUBCO; Initial_Board_Reference: mb1274; Component_Country_Of_Origin: China; ID: 2536; ShowFields: YES; Internal_Part_Number: MCD-00056; ComponentLink1Description: Datasheet; ECCN_US: n/a; ECCN_EU: n/a; Status: Released; Part_Type: Resistor; ComponentLink1URL: http://tunmcdsvn.tun.st.com/Component_Documentation_Library/Trunk/Resistor/YAGEO_RC_L_Series; Package: 0603; Order_Code_Digikey: 311-0.0GRCT-ND; Order_Code_Farnell: 9233130RL; Order_Code_RS: N/A
U38 = MCD-01130: 10/100/1000M GIGABIT Ethernet Transceiver, QFN40 , SMPS version; Manufacturer: REALTEK; Part_Type: IC; Part_Preference: Recommended; Provided_By: SUBCO; Initial_Board_Reference: MB1272; Component_Country_Of_Origin: Unknown; ID: 3370; ShowFields: YES; Value: RTL8211F-CG; Internal_Part_Number: MCD-01130; Manufacturer_Part_Number: RTL8211F-CG; ComponentLink1Description: Datasheet; ComponentLink1URL: http://tunmcdsvn.tun.st.com/Component_Documentation_Library/Trunk/IC/REALTEK_RTL8211F-CG; Status: Checked; ECCN_US: n/a; ECCN_EU: n/a; Order_Code_Digikey: N/A; Order_Code_Farnell: N/A; Order_Code_RS: N/A
U59 U60 = MCD-00667: 4-line ESD protection for high speed lines; BMS_Part_Number: 9179041; Part_Type: Diode; Part_Preference: Recommended; Manufacturer: STMICROELECTRONICS; Manufacturer_HQ_COO: EU; Component_Country_Of_Origin: Philippines; ShowFields: YES; ID: 3081; Internal_Part_Number: MCD-00667; Value: HSP051-4M10; Status: Released; Manufacturer_Part_Number: HSP051-4M10; Package: uQFN-10L; ComponentLink1URL: http://tunmcdsvn.tun.st.com/Component_Documentation_Library/Trunk/Diode/STMICROELECTRONICS_HSP051-4M10; Order_Code_Digikey: N/A; Order_Code_Farnell: N/A; Order_Code_RS: N/A
X4 = MCD-01463: Crystal 25Mhz, 10pF, -+50PPM, SMD; Part_Type: Crystal_Osc; Manufacturer_Part_Number: NX3225GA-25MHZ-EXS00A-CG06750; Manufacturer: NDK; BMS_Part_Number: 9157035; Part_Preference: Recommended; Provided_By: SUBCO; Initial_Board_Reference: MB1272B; Remark: footprint same as CRY_NX3225HA_4P; Component_Country_Of_Origin: Unknown; ID: 3563; ShowFields: YES; Internal_Part_Number: MCD-01463; Status: Checked; Package: 3.2x2.5mm; ComponentLink1Description: Datasheet; ComponentLink1URL: http://tunmcdsvn.tun.st.com/Component_Documentation_Library/Trunk/Crytal_Oscillator/NDK_NX3225GA_Series; Order_Code_Digikey: 644-1390; Order_Code_Farnell: N/A; Order_Code_RS: N/A

## Sheet HDMI.SchDoc: HDMI
size A3; Date: 01-DEC-2013; CompanyName: STMicroelectronics; Organization: Microcontrollers Division; Address1: 12, Rue Jules HOROWITZ; Address2: 38019 Grenoble; Address3: FRANCE; DocumentNumber: MB1272; Revision: A-01; SheetNumber: 10; SheetTotal: 18; Project: STM32MP25-DISCO
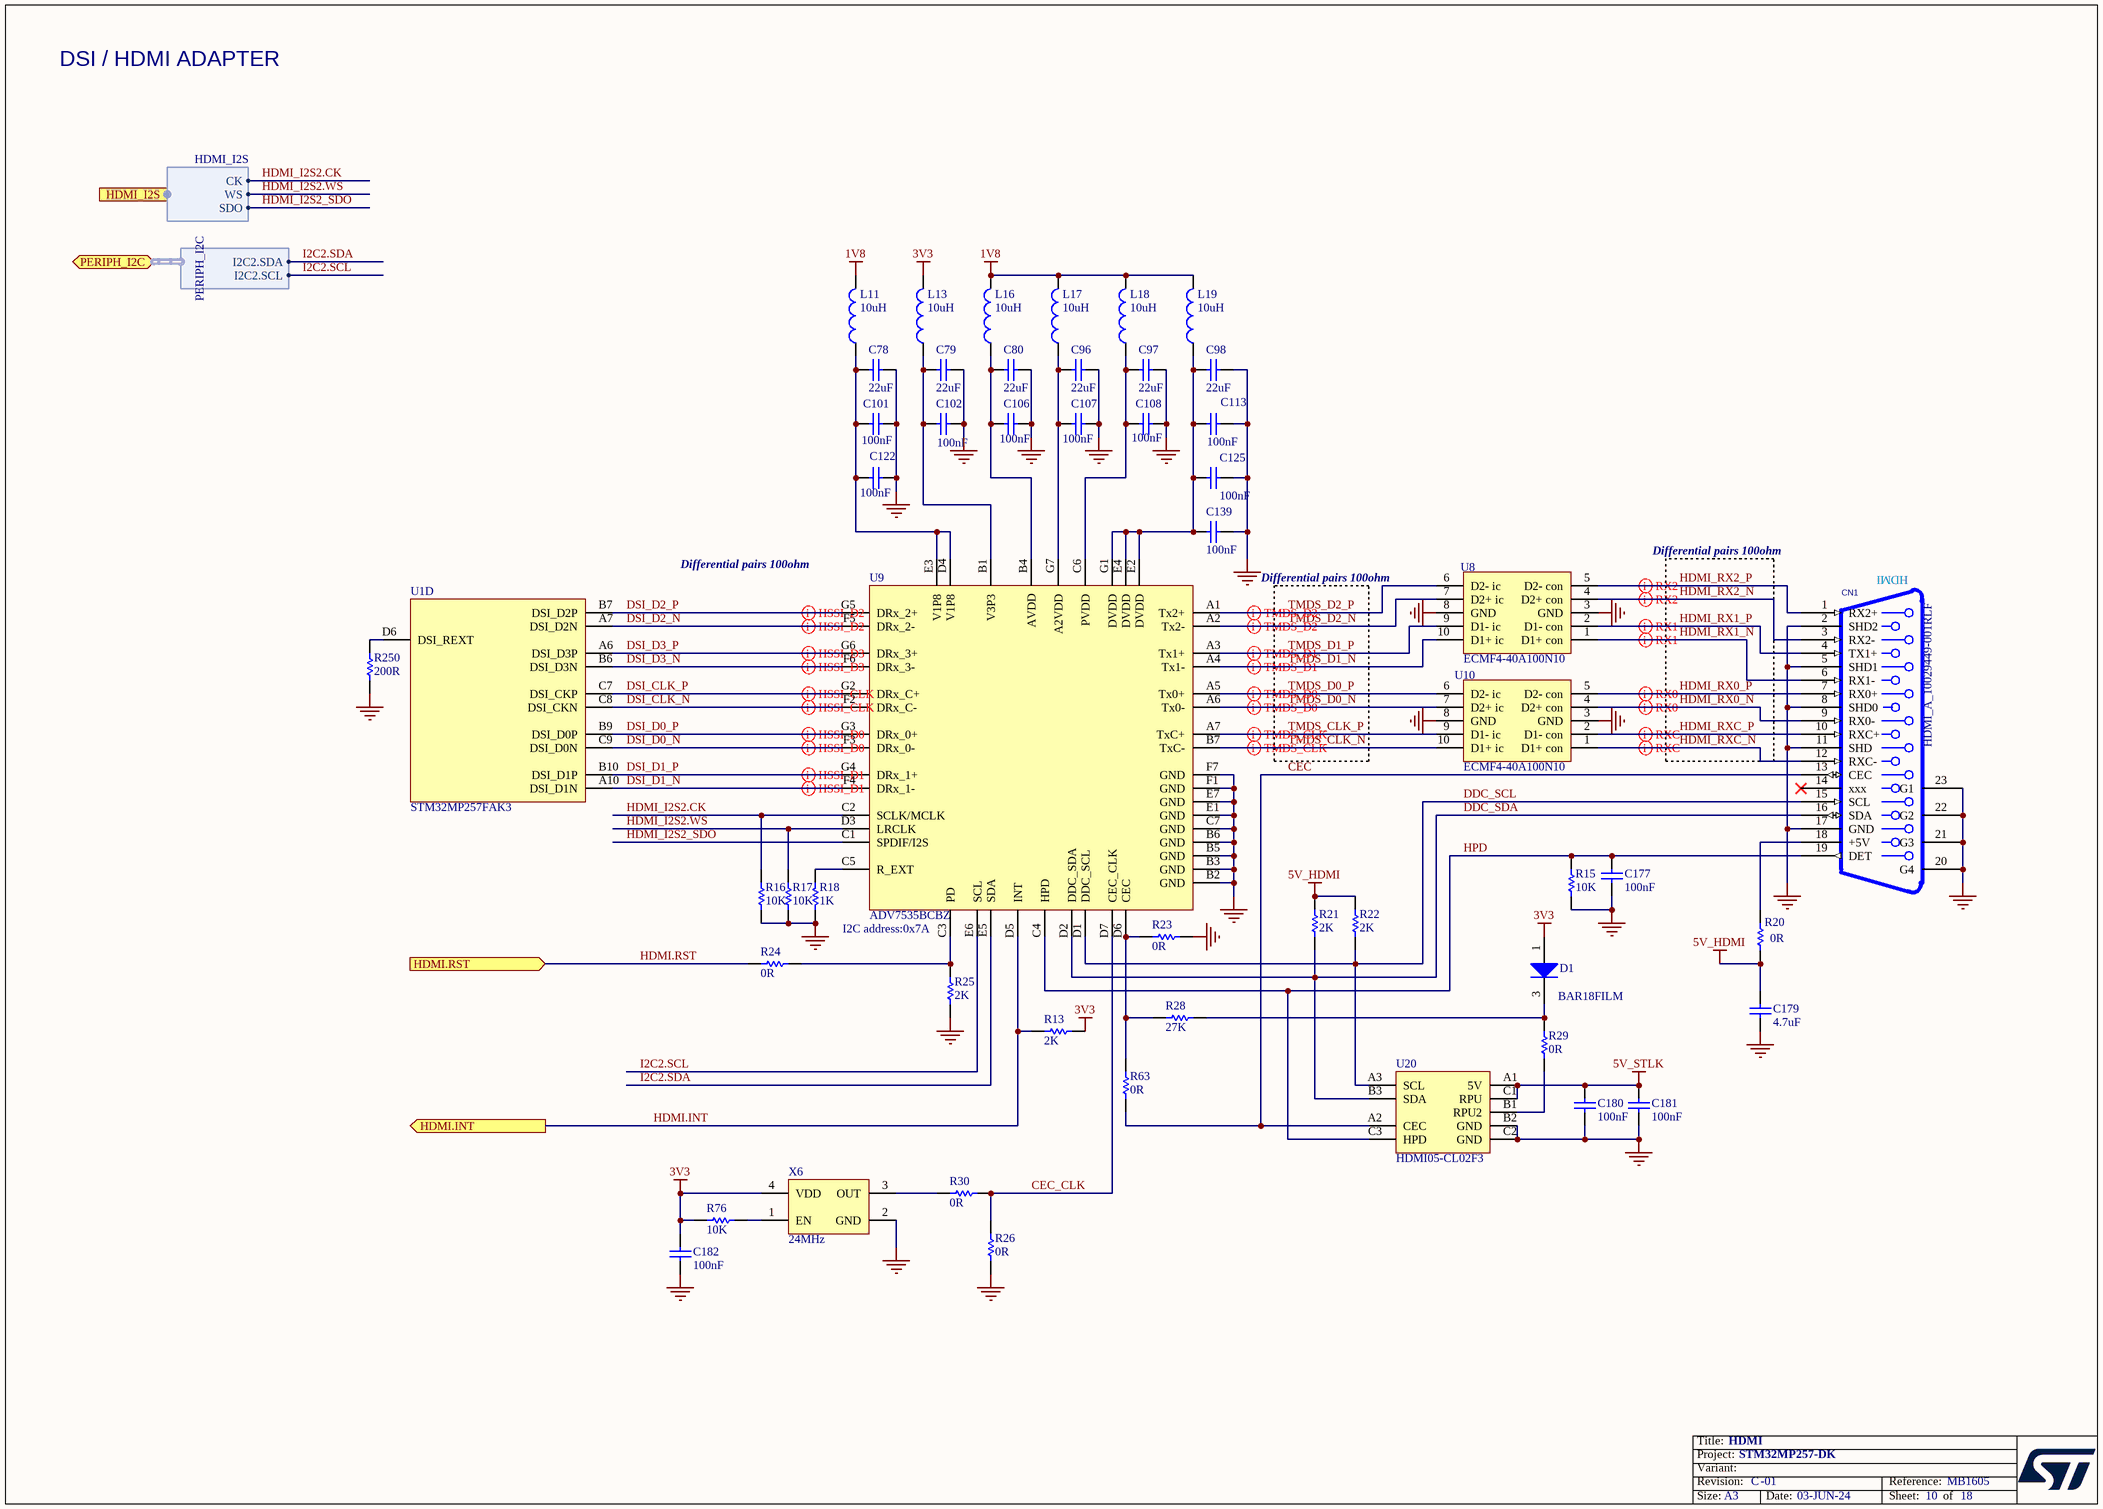
[diagram p17: HDMI.SchDoc]

### Parts
C78  value 22uF  [C0603]  (hidden comment: Capacitor)
C79  value 22uF  [C0603]  (hidden comment: Capacitor)
C80  value 22uF  [C0603]  (hidden comment: Capacitor)
C96  value 22uF  [C0603]  (hidden comment: Capacitor)
C97  value 22uF  [C0603]  (hidden comment: Capacitor)
C98  value 22uF  [C0603]  (hidden comment: Capacitor)
C101  value 100nF  [C0402]  (hidden comment: Capacitor)
C102  value 100nF  [C0402]  (hidden comment: Capacitor)
C106  value 100nF  [C0402]  (hidden comment: Capacitor)
C107  value 100nF  [C0402]  (hidden comment: Capacitor)
C108  value 100nF  [C0402]  (hidden comment: Capacitor)
C113  value 100nF  [C0402]  (hidden comment: Capacitor)
C122  value 100nF  [C0402]  (hidden comment: Capacitor)
C125  value 100nF  [C0402]  (hidden comment: Capacitor)
C139  value 100nF  [C0402]  (hidden comment: Capacitor)
C177  value 100nF  [C0402]  (hidden comment: Capacitor)
C179  value 4.7uF  [C0402]  (hidden comment: Capacitor)
C180  value 100nF  [C0402]  (hidden comment: Capacitor)
C181  value 100nF  [C0402]  (hidden comment: Capacitor)
C182  value 100nF  [C0402]  (hidden comment: Capacitor)
CN1  value HDMI_A_10029449-001RLF  [CON_HDMI_FCI-AMPHENOL_10029449-001RLF]  (hidden comment: HDMI_TypeA_DB19_7)
D1  value BAR18FILM  [DIO_SOT23_SC59_1A_2NC_3K_H1P4]  (hidden comment: DIODE_SOT23)
L11  value 10uH  [IND_0805_MURATA_LQM21]  (hidden comment: Inductor)
L13  value 10uH  [IND_0805_MURATA_LQM21]  (hidden comment: Inductor)
L16  value 10uH  [IND_0805_MURATA_LQM21]  (hidden comment: Inductor)
L17  value 10uH  [IND_0805_MURATA_LQM21]  (hidden comment: Inductor)
L18  value 10uH  [IND_0805_MURATA_LQM21]  (hidden comment: Inductor)
L19  value 10uH  [IND_0805_MURATA_LQM21]  (hidden comment: Inductor)
R13  value 2K  [R0402]  (hidden comment: Resistor)
R15  value 10K  [R0402]  (hidden comment: Resistor)
R16  value 10K  [R0402]  (hidden comment: Resistor)
R17  value 10K  [R0402]  (hidden comment: Resistor)
R18  value 1K  [R0402]  (hidden comment: Resistor)
R20  value 0R  [R0402]  (hidden comment: Resistor)
R21  value 2K  [R0402]  (hidden comment: Resistor)
R22  value 2K  [R0402]  (hidden comment: Resistor)
R23  value 0R  [R0402]  (hidden comment: Resistor)
R24  value 0R  [R0402]  (hidden comment: Resistor)
R25  value 2K  [R0402]  (hidden comment: Resistor)
R26  value 0R  [R0402]  (hidden comment: Resistor)
R28  value 27K  [R0603]  (hidden comment: Resistor)
R29  value 0R  [R0402]  (hidden comment: Resistor)
R30  value 0R  [R0402]  (hidden comment: Resistor)
R63  value 0R  [R0402]  (hidden comment: Resistor)
R76  value 10K  [R0402]  (hidden comment: Resistor)
R250  value 200R  [R0402]  (hidden comment: Resistor)
U1  STM32MP257FAK3  [ICC_TFBGA424_14X14_P050_H1P20_CODE-B0A2]  (part D of 9)
U8  ECMF4-40A100N10  [ESD_UQFN-10L_2P25X1P4_P040]
U9  ADV7535BCBZ  [ICC_WLCSP49_3P46X3P46_P050]
U10  ECMF4-40A100N10  [ESD_UQFN-10L_2P25X1P4_P040]
U20  HDMI05-CL02F3  [ESD_FLIP-CHIP_BGA9_1P14X1P14_P040]
X6  value 24MHz  [CRY_NZ2016SH_4P]  (hidden comment: OSCILLATOR_4_PINS)

### Ports
HDMI.INT (out), HDMI.RST (in), HDMI_I2S (harness HDMI_I2S), PERIPH_I2C (bidir, harness PERIPH_I2C)

### Harnesses
HDMI_I2S: CK, SDO, WS
PERIPH_I2C: I2C2.SDA, I2C2.SCL

### Nets
1V8: L11.2 L16.2 L17.2 L18.2 L19.2
3V3: C182.2 D1.1(A) L13.2 R13.1 R76.1 X6.4(VDD)
5V_HDMI: C179.2 R20.1 R21.2 R22.2
5V_STLK: C180.2 C181.2 U20.A1(5V) U20.C1(RPU)
GND: C78.2 C79.2 C80.2 C96.2 C97.2 C98.2 C101.1 C102.2 C106.2 C107.2 C108.1 C113.1 C122.1 C125.1 C139.1 C177.1 C179.1 C180.1 C181.1 C182.1 CN1.2(SHD2) CN1.5(SHD1) CN1.8(SHD0) CN1.11(SHD) CN1.17(GND) CN1.20(G4) CN1.21(G3) CN1.22(G2) CN1.23(G1) R15.2 R16.1 R17.1 R18.1 R23.2 R25.2 R26.1 R250.2 U8.3(GND) U8.8(GND) U9.B2(GND) U9.B3(GND) U9.B5(GND) U9.B6(GND) U9.C7(GND) U9.E1(GND) U9.E7(GND) U9.F1(GND) U9.F7(GND) U10.3(GND) U10.8(GND) U20.B2(GND) U20.C2(GND) X6.2(GND)
CEC: CN1.13(CEC) R63.1 U20.A2(CEC)
CEC_CLK: R26.2 R30.1 U9.D7(CEC_CLK)
DDC_SCL: CN1.15(SCL) R22.1 U9.D1(DDC_SCL) U20.A3(SCL)
DDC_SDA: CN1.16(SDA) R21.1 U9.D2(DDC_SDA) U20.B3(SDA)
DSI_CLK_N: U1.C8(DSI_CKN) U9.F2(DRx_C-)
DSI_CLK_P: U1.C7(DSI_CKP) U9.G2(DRx_C+)
DSI_D0_N: U1.C9(DSI_D0N) U9.F3(DRx_0-)
DSI_D0_P: U1.B9(DSI_D0P) U9.G3(DRx_0+)
DSI_D1_N: U1.A10(DSI_D1N) U9.F4(DRx_1-)
DSI_D1_P: U1.B10(DSI_D1P) U9.G4(DRx_1+)
DSI_D2_N: U1.A7(DSI_D2N) U9.F5(DRx_2-)
DSI_D2_P: U1.B7(DSI_D2P) U9.G5(DRx_2+)
DSI_D3_N: U1.B6(DSI_D3N) U9.F6(DRx_3-)
DSI_D3_P: U1.A6(DSI_D3P) U9.G6(DRx_3+)
HDMI.INT: R13.2 U9.D5(INT) ; port HDMI.INT
HDMI.RST: R24.1 ; port HDMI.RST
HDMI_I2S2.CK: R16.2 U9.C2(SCLK/MCLK) ; port HDMI_I2S.CK
HDMI_I2S2.WS: R17.2 U9.D3(LRCLK) ; port HDMI_I2S.WS
HDMI_I2S2_SDO: U9.C1(SPDIF/I2S) ; port HDMI_I2S.SDO
HDMI_RX0_N: CN1.9(RX0-) U10.4(D2+_con)
HDMI_RX0_P: CN1.7(RX0+) U10.5(D2-_con)
HDMI_RX1_N: CN1.6(RX1-) U8.1(D1+_con)
HDMI_RX1_P: CN1.4(TX1+) U8.2(D1-_con)
HDMI_RX2_N: CN1.3(RX2-) U8.4(D2+_con)
HDMI_RX2_P: CN1.1(RX2+) U8.5(D2-_con)
HDMI_RXC_N: CN1.12(RXC-) U10.1(D1+_con)
HDMI_RXC_P: CN1.10(RXC+) U10.2(D1-_con)
HPD: C177.2 CN1.19(DET) R15.1 U9.C4(HPD) U20.C3(HPD)
I2C2.SCL: U9.E6(SCL) ; port PERIPH_I2C.I2C2.SCL
I2C2.SDA: U9.E5(SDA) ; port PERIPH_I2C.I2C2.SDA
TMDS_CLK_N: U9.B7(TxC-) U10.10(D1+_ic)
TMDS_CLK_P: U9.A7(TxC+) U10.9(D1-_ic)
TMDS_D0_N: U9.A6(Tx0-) U10.7(D2+_ic)
TMDS_D0_P: U9.A5(Tx0+) U10.6(D2-_ic)
TMDS_D1_N: U8.10(D1+_ic) U9.A4(Tx1-)
TMDS_D1_P: U8.9(D1-_ic) U9.A3(Tx1+)
TMDS_D2_N: U8.7(D2+_ic) U9.A2(Tx2-)
TMDS_D2_P: U8.6(D2-_ic) U9.A1(Tx2+)
NetC78_1: C78.1 C101.2 C122.2 L11.1 U9.D4(V1P8) U9.E3(V1P8)
NetC79_1: C79.1 C102.1 L13.1 U9.B1(V3P3)
NetC80_1: C80.1 C106.1 L16.1 U9.B4(AVDD)
NetC96_1: C96.1 C107.1 L17.1 U9.G7(A2VDD)
NetC97_1: C97.1 C108.2 L18.1 U9.C6(PVDD)
NetC98_1: C98.1 C113.2 C125.2 C139.2 L19.1 U9.E2(DVDD) U9.E4(DVDD) U9.G1(DVDD)
NetCN1_18: CN1.18(+5V) R20.2
NetD1_3: D1.3(K) R28.1 R29.2
NetR18_2: R18.2 U9.C5(R_EXT)
NetR23_1: R23.1 R28.2 R63.2 U9.D6(CEC)
NetR24_2: R24.2 R25.1 U9.C3(PD)
NetR29_1: R29.1 U20.B1(RPU2)
NetR30_2: R30.2 X6.3(OUT)
NetR76_2: R76.2 X6.1(EN)
NetR250_1: R250.1 U1.D6(DSI_REXT)

Not connected (* = marked no-connect by the designer): CN1 14(xxx)*

### Layout directives
differential pair: DSI_CLK_N, DSI_CLK_P, DSI_D0_N, DSI_D0_P, DSI_D1_N, DSI_D1_P, DSI_D2_N, DSI_D2_P, DSI_D3_N, DSI_D3_P, HDMI_RX0_N, HDMI_RX0_P, HDMI_RX1_N, HDMI_RX1_P, HDMI_RX2_N, HDMI_RX2_P, HDMI_RXC_N, HDMI_RXC_P, TMDS_CLK_N, TMDS_CLK_P, TMDS_D0_N, TMDS_D0_P, TMDS_D1_N, TMDS_D1_P, TMDS_D2_N, TMDS_D2_P

### Notes on the sheet
- DSI / HDMI ADAPTER
- (near U9) Differential pairs 100ohm
- Differential pairs 100ohm
- (near CN1) HDMI
- (near U9) I2C address:0x7A
- Title:
- Project:
- Size:
- Revision:
- Variant:
- A3
- -
- Date:
- Reference:
- Sheet:
- of

### Library data of the parts
C78-C80 C96-C98 = MCD-00100: Capacitor, MLCC, 22uF, 6V3, X5R, +/-20%, 0603, T=0.8mm; Part_Preference: Recommended; Manufacturer: MURATA; Manufacturer_Part_Number: GRM188R60J226MEA0J; Component_Country_Of_Origin: Japan; ShowFields: YES; ID: 2766; Internal_Part_Number: MCD-00100; Status: Released; Part_Type: Capacitor; Package: 0603; ComponentLink1URL: http://tunmcdsvn.tun.st.com/Component_Documentation_Library/Trunk/Capacitor/MURATA_GRM_Series; Order_Code_Digikey: 490-7612-2-ND; Order_Code_Farnell: N/A; Order_Code_RS: N/A
C101 C102 C106-C108 C113 C122 C125 C139 = MCD-00006: Capacitor, MLCC, 100nF, 16V, X7R, +/-10%, 0402, T=0.5mm; Part_Preference: Recommended; Manufacturer: YAGEO; Manufacturer_Part_Number: CC0402KRX7R7BB104; Partial_Alternate_Internal_Part_Number: MCD-03299; Order_Code_RS: 616-9701; Component_Country_Of_Origin: China; ShowFields: YES; ID: 2474; Alternate_EMS: M; Internal_Part_Number: MCD-00006; Status: Released; Part_Type: Capacitor; Package: 0402; ComponentLink1URL: http://tunmcdsvn.tun.st.com/Component_Documentation_Library/Trunk/Capacitor/YAGEO_X7R_Series; Order_Code_Digikey: 311-1338-1-ND; Order_Code_Farnell: 9402047
C177 C180-C182 = MCD-00006: Capacitor, MLCC, 100nF, 16V, X7R, +/-10%, 0402, T=0.5mm; Part_Preference: Recommended; Manufacturer: YAGEO; Manufacturer_Part_Number: CC0402KRX7R7BB104; Partial_Alternate_Internal_Part_Number: MCD-03299; Order_Code_RS: 616-9701; Component_Country_Of_Origin: China; ID: 2474; ShowFields: YES; Alternate_EMS: M; Internal_Part_Number: MCD-00006; Status: Released; Part_Type: Capacitor; Package: 0402; ComponentLink1URL: http://tunmcdsvn.tun.st.com/Component_Documentation_Library/Trunk/Capacitor/YAGEO_X7R_Series; Order_Code_Digikey: 311-1338-1-ND; Order_Code_Farnell: 9402047
C179 = MCD-01356: Capacitor, MLCC, 4.7uF, 6V3, X5R, +/-20%, 0402, T=0.5mm; Part_Preference: Recommended; Manufacturer: MURATA; Manufacturer_Part_Number: GRM155R60J475ME47; Order_Code_RS: 814-5230; Component_Country_Of_Origin: Japan; ShowFields: YES; ID: 3456; Internal_Part_Number: MCD-01356; Status: Released; Part_Type: Capacitor; Package: 0402; ComponentLink1URL: http://tunmcdsvn.tun.st.com/Component_Documentation_Library/Trunk/Capacitor/MURATA_GRM_Series; Order_Code_Digikey: 490-5915-1-ND; Order_Code_Farnell: 2666407
CN1 = MCD-00307: HDMI_Type A, Receptacle, 19x1, 0.5mm, VR, SMD, T= 6.1mm; Part_Type: Connector; Part_Preference: Recommended; Manufacturer: AMPHENOL ICC; Manufacturer_Part_Number: 10029449-001RLF; Order_Code_RS: 162-1999; Component_Country_Of_Origin: China; ShowFields: YES; ID: 2561; Internal_Part_Number: MCD-00307; Status: Checked; ComponentLink1URL: http://tunmcdsvn.tun.st.com/Component_Documentation_Library/Trunk/Connector/AMPHENOL_ICC_10029449_Series/; Order_Code_Digikey: 609-1010-2-ND; Order_Code_Farnell: 3367498
D1 = MCD-02333: Diode, Ultrafast and RF switching diode, VF=0.41V@IF=1mA, VBR=70V; Part_Preference: Recommended; Manufacturer: STMICROELECTRONICS; Order_Code_RS: 165-7525; Component_Country_Of_Origin: China; ShowFields: YES; ID: 4439; Internal_Part_Number: MCD-02333; Status: Checked; Part_Type: Diode; Manufacturer_Part_Number: BAR18FILM; Package: SOT-23; ComponentLink1URL: http://tunmcdsvn.tun.st.com/Component_Documentation_Library/Trunk/Diode/STMICROELECTRONICS_BAR18_Series; Order_Code_Digikey: 497-2529-2-ND; Order_Code_Farnell: 9801340RL
L11 L13 L16-L19 = MCD-02317: Inductor, 10uH, +/-20%, Isat 100mA, DCR 0.5Ohm,; Part_Preference: Recommended; Manufacturer: MURATA; Manufacturer_Part_Number: LQM21FN100M80L; Alternate_Manufacturer: TDK; Alternate_Manufacturer_Part_Number: MLZ2012M100WT000; Order_Code_RS: 786-7074; Component_Country_Of_Origin: Japan; ID: 4423; ShowFields: YES; Internal_Part_Number: MCD-02317; Status: Checked; Part_Type: Inductor; Package: 0805; ComponentLink1URL: http://tunmcdsvn.tun.st.com/Component_Documentation_Library/Trunk/Inductor/MURATA_LQM_Series; Order_Code_Digikey: 490-6682-2-ND; Order_Code_Farnell: 2470323
R13 R21 R22 R25 = MCD-00419: Resistor, 2K, 0402, +/-1%, 1/16W; Part_Preference: Recommended; Manufacturer: YAGEO; Manufacturer_Part_Number: RC0402FR-072KL; Component_Country_Of_Origin: China; ID: 2861; ShowFields: YES; Internal_Part_Number: MCD-00419; Status: Released; Part_Type: Resistor; Package: 0402; ComponentLink1URL: http://tunmcdsvn.tun.st.com/Component_Documentation_Library/Trunk/Resistor/YAGEO_RC_L_Series; Order_Code_Digikey: 311-2KLRCT-ND; Order_Code_Farnell: 1458757RL; Order_Code_RS: N/A
R15-R17 R76 = MCD-00053: Resistor, 10K, 0402, +/-1%, 1/16W; Part_Preference: Recommended; Manufacturer: YAGEO; Manufacturer_Part_Number: RC0402FR-0710KL; BMS_Part_Number: 9131590; Component_Country_Of_Origin: China; ID: 2539; ShowFields: YES; Internal_Part_Number: MCD-00053; Status: Released; Part_Type: Resistor; Package: 0402; ComponentLink1URL: http://tunmcdsvn.tun.st.com/Component_Documentation_Library/Trunk/Resistor/YAGEO_RC_L_Series; Order_Code_Digikey: 311-10.0KLRCT-ND; Order_Code_Farnell: 9239359; Order_Code_RS: N/A
R18 = MCD-00061: Resistor, 1K, 0402, +/-1%,1/16W; Part_Preference: Recommended; Manufacturer: YAGEO; Manufacturer_Part_Number: RC0402FR-071KL; Component_Country_Of_Origin: China; ID: 2532; ShowFields: YES; Internal_Part_Number: MCD-00061; Status: Released; Part_Type: Resistor; Package: 0402; ComponentLink1URL: http://tunmcdsvn.tun.st.com/Component_Documentation_Library/Trunk/Resistor/YAGEO_RC_L_Series; Order_Code_Digikey: 311-1.00KLRCT-ND; Order_Code_Farnell: 9239235; Order_Code_RS: N/A
R20 R23 R24 R26 R29 R30 R63 = MCD-00052: Resistor, 0R, 0402, +/-5%, 1/16W; Part_Preference: Recommended; Manufacturer: YAGEO; Manufacturer_Part_Number: RC0402JR-070RL; Order_Code_RS: 618-5804; Component_Country_Of_Origin: China; ShowFields: YES; ID: 2540; Internal_Part_Number: MCD-00052; Status: Released; Part_Type: Resistor; Package: 0402; ComponentLink1URL: http://tunmcdsvn.tun.st.com/Component_Documentation_Library/Trunk/Resistor/YAGEO_RC_L_Series; Order_Code_Digikey: 311-0.0JRCT-ND; Order_Code_Farnell: 9232516RL
R28 = MCD-00444: Resistor, 27K, 0603, +/-1%, 1/10W; Part_Preference: Recommended; Manufacturer: YAGEO; Manufacturer_Part_Number: RC0603FR-0727KL; Component_Country_Of_Origin: China; ShowFields: YES; ID: 2833; Internal_Part_Number: MCD-00444; Status: Released; Part_Type: Resistor; Package: 0603; ComponentLink1URL: http://tunmcdsvn.tun.st.com/Component_Documentation_Library/Trunk/Resistor/YAGEO_RC_L_Series; Order_Code_Digikey: 311-27.0KHRCT-ND; Order_Code_Farnell: 9238654; Order_Code_RS: N/A
R250 = MCD-00417: Resistor, 200R, 0402, +/-1%, 1/16W; Manufacturer_Part_Number: RC0402FR-07200RL; Manufacturer: YAGEO; Part_Preference: Recommended; Component_Country_Of_Origin: China; ID: 2860; ShowFields: YES; Internal_Part_Number: MCD-00417; Status: Released; Part_Type: Resistor; Package: 0402; ComponentLink1URL: http://tunmcdsvn.tun.st.com/Component_Documentation_Library/Trunk/Resistor/YAGEO_RC_L_Series; Order_Code_Digikey: 311-200LRCT-ND; Order_Code_Farnell: 1458756; Order_Code_RS: N/A
U1 = MCD-03375: MPU , 2xCortex-A35@1.5GHz, Cortex-M33@400MHz, TFBGA 14x14, pitch 0.5, 648KB SRAM, With Crypto; Part_Type: IC; Part_Preference: Recommended; Manufacturer: STMICROELECTRONICS; Component_Country_Of_Origin: Unknown; ShowFields: YES; ID: 5491; Value: STM32MP257FAK3; Internal_Part_Number: MCD-03375; Status: Checked; Manufacturer_Part_Number: STM32MP257FAK3; Package: TFBGA; ComponentLink1URL: http://tunmcdsvn.tun.st.com/Component_Documentation_Library/Trunk/IC/STMICROELECTRONICS_STM32MP257FAK3; Order_Code_Digikey: N/A; Order_Code_Farnell: N/A; Order_Code_RS: N/A
U8 U10 = MCD-03059: ESD protection & Common Filter High Speed serial Interfaces , 0.4 pitch; Part_Type: IC; Part_Preference: Recommended; Manufacturer: STMICROELECTRONICS; ShowFields: YES; ID: 5175; Component_Country_Of_Origin: China; ComponentLink1Description: Datasheet; ComponentLink1URL: http://tunmcdsvn.tun.st.com/Component_Documentation_Library/Trunk/IC/STMICROELECTRONICS_ECMF4-40A100N10; Internal_Part_Number: MCD-03059; Value: ECMF4-40A100N10; Status: Checked; Manufacturer_Part_Number: ECMF4-40A100N10; Package: uQFN-10L; Order_Code_Digikey: 497-ECMF4-40A100N10; Order_Code_Farnell: N/A; Order_Code_RS: N/A
U9 = MCD-02315: MIPI/DSI Receiver with HDMI Transmitter; Part_Type: IC; Part_Preference: Recommended; Manufacturer: ANALOG DEVICES; Component_Country_Of_Origin: Singapore; ShowFields: YES; ID: 4421; Value: ADV7535BCBZ; Order_code_Digikey: N/A; Order_code_Farnell: N/A; Order_code_RS: N/A; Status: Checked; ComponentLink1URL: http://tunmcdsvn.tun.st.com/Component_Documentation_Library/Trunk/IC/ANALOG_DEVICES_ADV7535BCBZ; Internal_Part_Number: MCD-02315; Manufacturer_Part_Number: ADV7535BCBZ; Package: WLCSP-49 pitch 0.5mm
U20 = MCD-02316: 5-line HDMI control line ESD protection; Part_Type: IC; Part_Preference: Recommended; Manufacturer: STMICROELECTRONICS; Component_Country_Of_Origin: France; ShowFields: YES; ID: 4422; Value: HDMI05-CL02F3; Order_code_Digikey: 497-8885-2-ND; Order_code_Farnell: 3130057RL; Order_code_RS: N/A; Status: Checked; ComponentLink1URL: http://tunmcdsvn.tun.st.com/Component_Documentation_Library/Trunk/IC/STMICROELECTRONICS_HDMI05-CL02F3; Internal_Part_Number: MCD-02316; Manufacturer_Part_Number: HDMI05-CL02F3; Package: Flip Chip 9 bumps 0.4 mm pitch
X6 = MCD-01627: Oscillator, SPXO, 24MHz, +/-50ppm, square wave, 3V3, 2x1.6mm; BMS_Part_Number: 9157051; Part_Type: Crystal_Osc; Part_Preference: Recommended; Manufacturer: NDK; Manufacturer_Part_Number: NZ2016SH-24MHZ-END4869F; Component_Country_Of_Origin: Unknown; ShowFields: YES; ID: 3727; Internal_Part_Number: MCD-01627; Status: Released; Package: 2x1.6mm; ComponentLink1URL: http://tunmcdsvn.tun.st.com/Component_Documentation_Library/Trunk/Crytal_Oscillator/NDK_NZ2016SH_Series; Order_Code_Digikey: N/A; Order_Code_Farnell: N/A; Order_Code_RS: N/A